# Altium schematic sheet Backpage.SchDoc: uInverter Backpage
size Letter; Engineer: Nikhil Deshpande; Revision: A; SheetNumber: 3; SheetTotal: 3
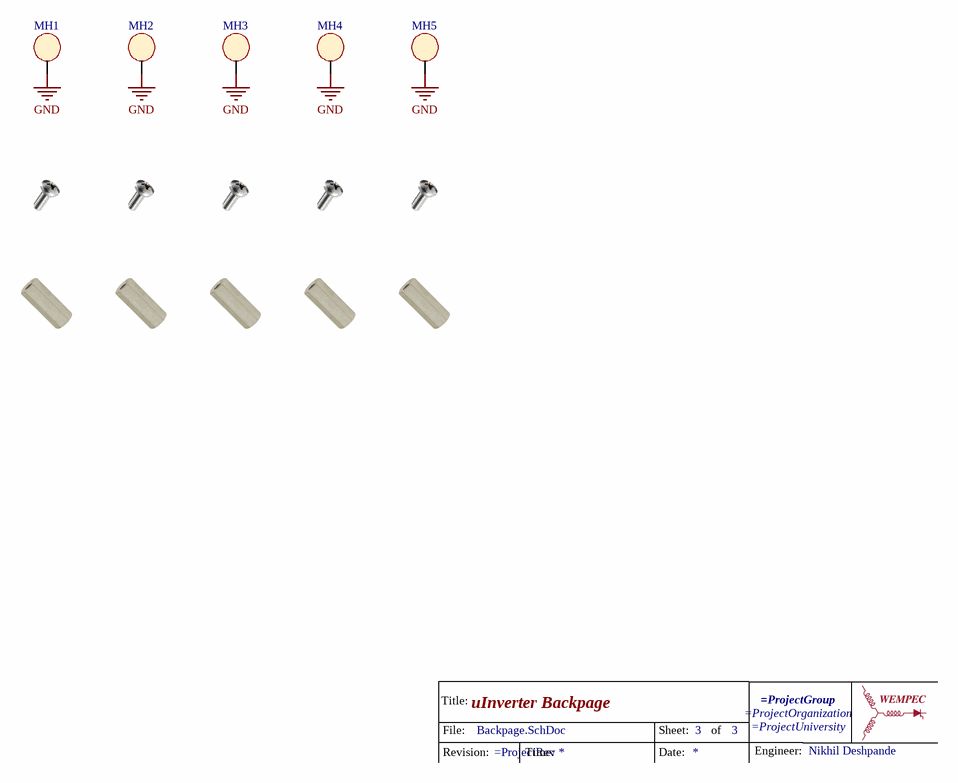
[diagram p0: Backpage.SchDoc]

## Parts
MH1  MOUNT_HOLE  [MOUNTING_HOLE]  (value not drawn)
MH2  MOUNT_HOLE  [MOUNTING_HOLE]  (value not drawn)
MH3  MOUNT_HOLE  [MOUNTING_HOLE]  (value not drawn)
MH4  MOUNT_HOLE  [MOUNTING_HOLE]  (value not drawn)
MH5  MOUNT_HOLE  [MOUNTING_HOLE]  (value not drawn)
SCREW1  Screw-4-40  (value not drawn)
SCREW2  Screw-4-40  (value not drawn)
SCREW3  Screw-4-40  (value not drawn)
SCREW4  Screw-4-40  (value not drawn)
SCREW5  Screw-4-40  (value not drawn)
STANDOFF1  Standoff-4-40  (value not drawn)
STANDOFF2  Standoff-4-40  (value not drawn)
STANDOFF3  Standoff-4-40  (value not drawn)
STANDOFF4  Standoff-4-40  (value not drawn)
STANDOFF5  Standoff-4-40  (value not drawn)
TitleBlockWEMPEC3  TitleBlockWEMPEC  (value not drawn)

## Nets
GND: MH1.1 MH2.1 MH3.1 MH4.1 MH5.1

## Notes on the sheet
- (in symbol TitleBlockWEMPEC) Title:; File:; Sheet:; of; Engineer:; Revision:; Time:; Date:

## Library data of the parts
MH1-MH5 = MOUNT_HOLE: MOUNTING HOLE
SCREW1-SCREW5 = Screw-4-40: Supplier 1: Digi-Key; Supplier Part Number 1: KEY1046-ND
STANDOFF1-STANDOFF5 = Standoff-4-40: Supplier 1: Digi-Key; Supplier Part Number 1: 36-1656-ND